# EAGLE board AdamOBrien_IOT2_PicController (EAGLE 9.6.2), part 1 of 2
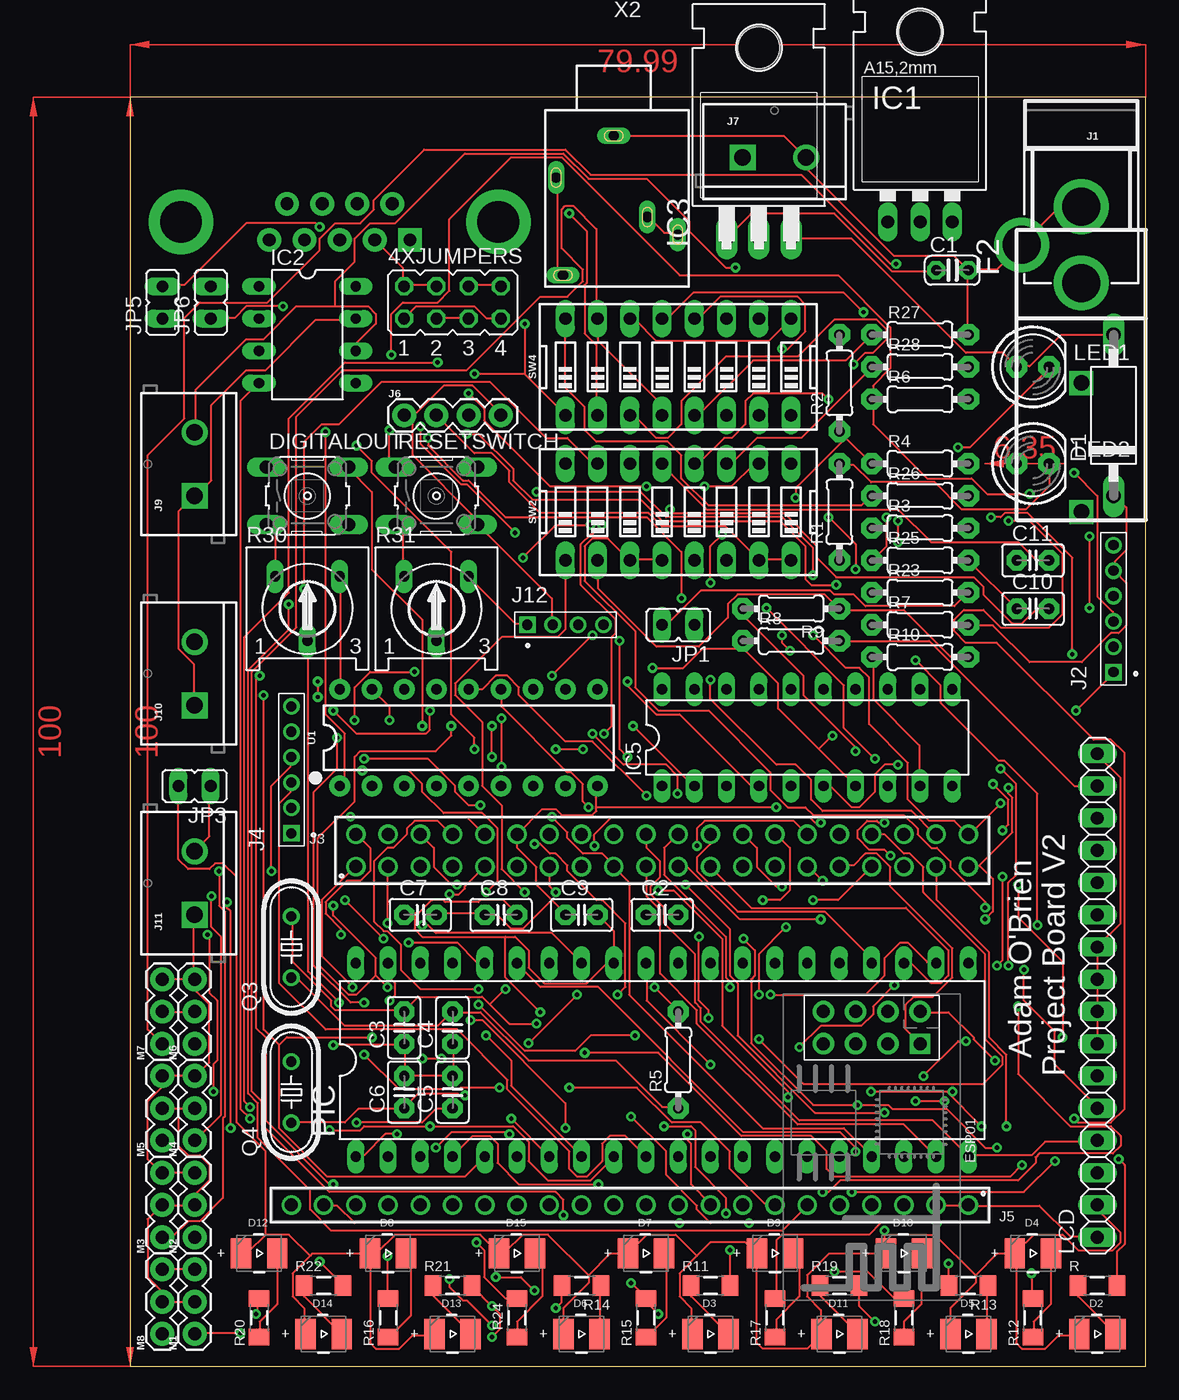
[diagram p2: board, top side]
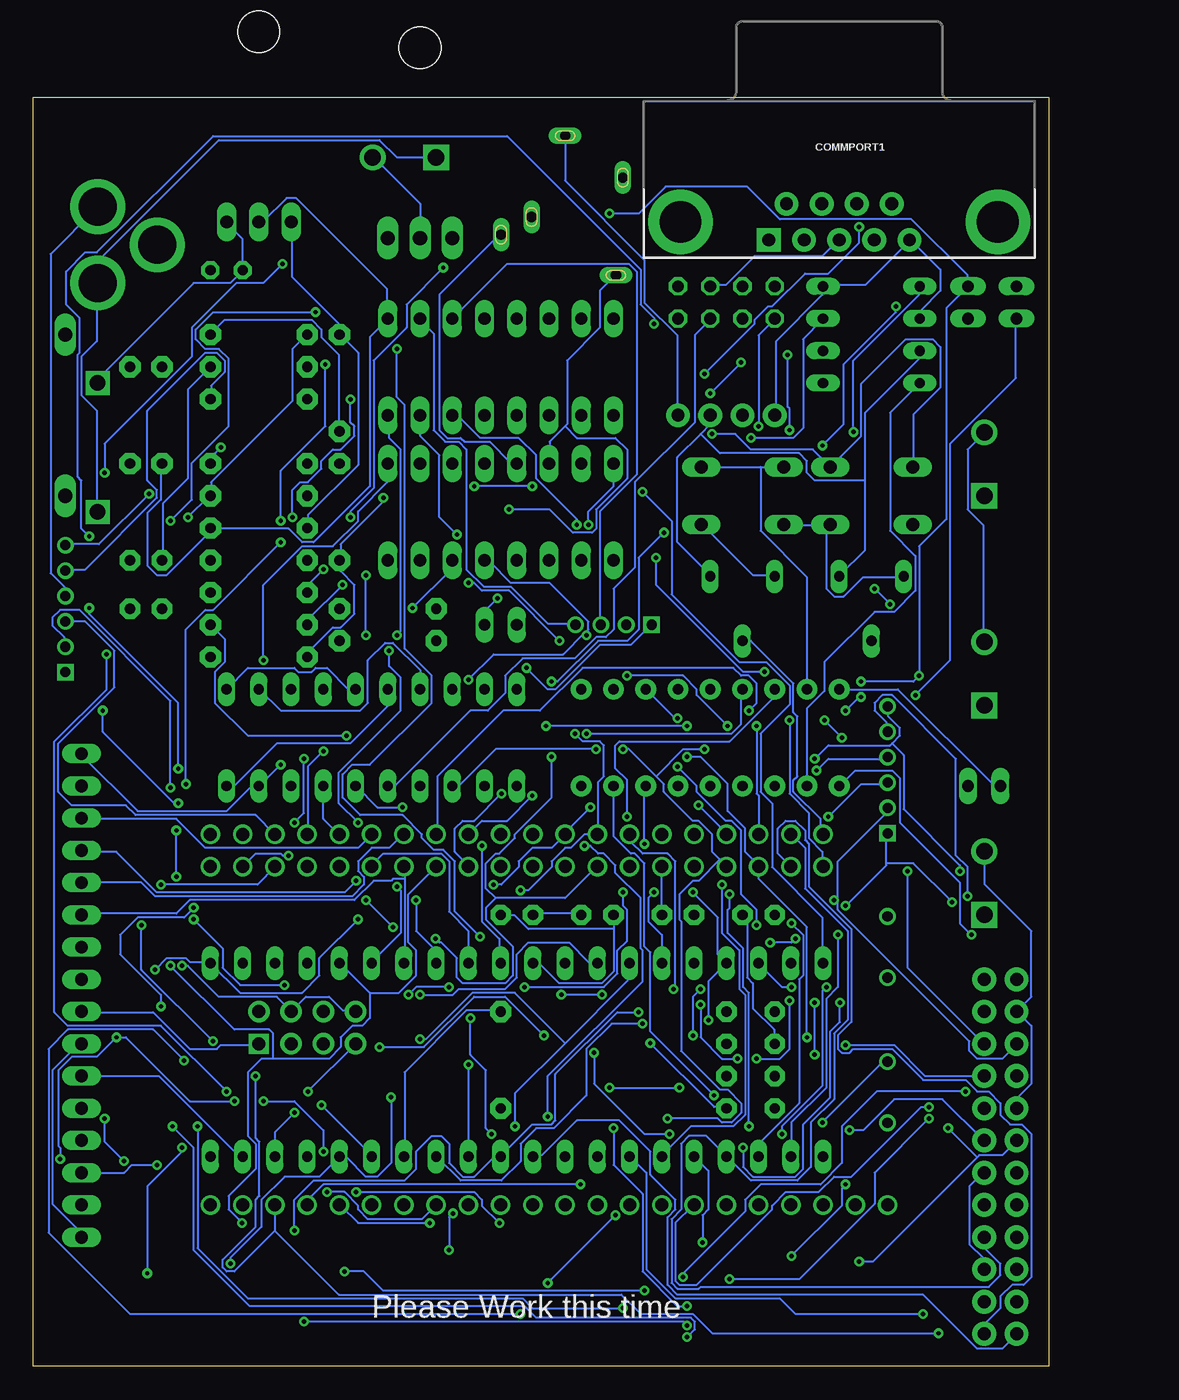
[diagram p3: board, bottom side, seen from below]

Size 79.99 x 100 mm. Coordinates in mm from the lower left corner, seen from the top.
Outline: 0,0 79.99,0 79.99,100 0,100 0,0
Copper layers (1*16): Top 0.035mm / dielectric 1.5mm / Bottom 0.035mm
Design rules "default": minimum track width 6mil, minimum drill 0.35mm, track to track 6mil, track to pad 6mil, pad to pad 6mil, via to via 6mil, smd to smd 6mil, copper to edge 40mil, drill to drill 6mil, minimum pad ring 10mil, minimum via ring 8mil, stop-mask expansion 4mil, vias tented up to drill 0mil, thermal gap 10mil

## Footprints (pad centres in the part's own frame; a part is rotated, then mirrored left to right if it is on the bottom)
JP4Q = drill 0.914 octagon: 1 -3.81,-1.27; 2 -3.81,1.27; 3 -1.27,-1.27; 4 -1.27,1.27; 5 1.27,-1.27; 6 1.27,1.27; 7 3.81,-1.27; 8 3.81,1.27
C025-024X044 = drill 0.813 pad 1.422 octagon: 1 -1.27,0; 2 1.27,0
C2.5-2 = drill 0.813 pad 1.6 octagon: 1 -1.27,0; 2 1.27,0
DB9 = drill 1.016 pad 1.88 square: 1 -5.54,-1.42 | drill 1.016 pad 1.88: 2 -2.77,-1.42; 3 0,-1.42; 4 2.77,-1.42; 5 5.54,-1.42; 6 -4.15,1.42; 7 -1.38,1.42; 8 1.38,1.42; 9 4.15,1.42 | drill 3.302 pad 5.08: G1 -12.5,0; G2 12.5,0
DO15-12 = drill 1.118 long: A 6.35,0; C -6.35,0
WL-SITW_3528 = smd 1.6 x 2.4: 1 -1.425,0; 2 1.425,0
B3F-10XX = drill 1.016 long: 1 -3.251,2.261; 2 3.251,2.261; 3 -3.251,-2.261; 4 3.251,-2.261
ESP8266_ESP-01_NO-SILKSCREEN = drill 1.016 pad 1.7: 3V3 -1.27,-3.81; EN/CH_PD -1.27,1.27; GPIO0 1.27,-1.27; GPIO2 1.27,1.27; RST -1.27,-1.27; RX 1.27,-3.81; TX -1.27,3.81 | drill 1.016 pad 1.6 square: GND 1.27,3.81
FUSE_HOLDER_MENTOR-1821 = drill 1.219 pad 1.905 square: A 10.16,0; B 0,0
TO220L1 = drill 1.016 long: 1 -2.54,-3.81; 2 0,-3.81; 3 2.54,-3.81 | hole 3.302: 0,11.176
DIL08 = drill 0.813 long: 1 -3.81,-3.81; 2 -1.27,-3.81; 3 1.27,-3.81; 4 3.81,-3.81; 5 3.81,3.81; 6 1.27,3.81; 7 -1.27,3.81; 8 -3.81,3.81
TO220H = drill 1.118 long: 1 -2.54,-10.16; 2 0,-10.16; 3 2.54,-10.16 | hole 3.302: 0,4.826
DIL20 = drill 0.813 long: 1 -11.43,-3.81; 2 -8.89,-3.81; 3 -6.35,-3.81; 4 -3.81,-3.81; 5 -1.27,-3.81; 6 1.27,-3.81; 7 3.81,-3.81; 8 6.35,-3.81; 9 8.89,-3.81; 10 11.43,-3.81; 11 11.43,3.81; 12 8.89,3.81; 13 6.35,3.81; 14 3.81,3.81; 15 1.27,3.81; 16 -1.27,3.81; 17 -3.81,3.81; 18 -6.35,3.81; 19 -8.89,3.81; 20 -11.43,3.81
POWER_JACK_PTH = drill 2.997 pad 4.318: GND 0,7.7; GNDBREAK 4.7,10.7; PWR 0,13.7
62000611121 = drill 0.8 square: 1 -5,0 | drill 0.8: 2 -3,0; 3 -1,0; 4 1,0; 5 3,0; 6 5,0
61304021821 = drill 1.02: 1 -24.13,-1.27; 2 -24.13,1.27; 3 -21.59,-1.27; 4 -21.59,1.27; 5 -19.05,-1.27; 6 -19.05,1.27; 7 -16.51,-1.27; 8 -16.51,1.27; 9 -13.97,-1.27; 10 -13.97,1.27; 11 -11.43,-1.27; 12 -11.43,1.27; 13 -8.89,-1.27; 14 -8.89,1.27; 15 -6.35,-1.27; 16 -6.35,1.27; 17 -3.81,-1.27; 18 -3.81,1.27; 19 -1.27,-1.27; 20 -1.27,1.27; 21 1.27,-1.27; 22 1.27,1.27; 23 3.81,-1.27; 24 3.81,1.27; 25 6.35,-1.27; 26 6.35,1.27; 27 8.89,-1.27; 28 8.89,1.27; 29 11.43,-1.27; 30 11.43,1.27; 31 13.97,-1.27; 32 13.97,1.27; 33 16.51,-1.27; 34 16.51,1.27; 35 19.05,-1.27; 36 19.05,1.27; 37 21.59,-1.27; 38 21.59,1.27; 39 24.13,-1.27; 40 24.13,1.27
61302211821 = drill 1.02: 1 -26.67,0; 2 -24.13,0; 3 -21.59,0; 4 -19.05,0; 5 -16.51,0; 6 -13.97,0; 7 -11.43,0; 8 -8.89,0; 9 -6.35,0; 10 -3.81,0; 11 -1.27,0; 12 1.27,0; 13 3.81,0; 14 6.35,0; 15 8.89,0; 16 11.43,0; 17 13.97,0; 18 16.51,0; 19 19.05,0; 20 21.59,0; 21 24.13,0; 22 26.67,0
1X04 = drill 1.016 pad 1.88: 1 0,0; 2 2.54,0; 3 5.08,0; 4 7.62,0
SCREWTERMINAL-5MM-2 = drill 1.3 pad 2.032 square: 1 0,0 | drill 1.3 pad 2.032: 2 5,0
62000411121 = drill 0.8 square: 1 -3,0 | drill 0.8: 2 -1,0; 3 1,0; 4 3,0
JP1 = drill 0.914 long: 1 0,-1.27; 2 0,1.27
1X16 = drill 1.016 long: 1 -19.05,0; 2 -16.51,0; 3 -13.97,0; 4 -11.43,0; 5 -8.89,0; 6 -6.35,0; 7 -3.81,0; 8 -1.27,0; 9 1.27,0; 10 3.81,0; 11 6.35,0; 12 8.89,0; 13 11.43,0; 14 13.97,0; 15 16.51,0; 16 19.05,0
LED5MM = drill 0.813 pad 1.676 octagon: A -1.27,0; K 1.27,0
1X03 = drill 1.016 pad 1.88: 1 0,0; 2 2.54,0; 3 5.08,0
DIL40 = drill 0.813 long: 1 -24.13,-7.62; 2 -21.59,-7.62; 3 -19.05,-7.62; 4 -16.51,-7.62; 5 -13.97,-7.62; 6 -11.43,-7.62; 7 -8.89,-7.62; 8 -6.35,-7.62; 9 -3.81,-7.62; 10 -1.27,-7.62; 11 1.27,-7.62; 12 3.81,-7.62; 13 6.35,-7.62; 14 8.89,-7.62; 15 11.43,-7.62; 16 13.97,-7.62; 17 16.51,-7.62; 18 19.05,-7.62; 19 21.59,-7.62; 20 24.13,-7.62; 21 24.13,7.62; 22 21.59,7.62; 23 19.05,7.62; 24 16.51,7.62; 25 13.97,7.62; 26 11.43,7.62; 27 8.89,7.62; 28 6.35,7.62; 29 3.81,7.62; 30 1.27,7.62; 31 -1.27,7.62; 32 -3.81,7.62; 33 -6.35,7.62; 34 -8.89,7.62; 35 -11.43,7.62; 36 -13.97,7.62; 37 -16.51,7.62; 38 -19.05,7.62; 39 -21.59,7.62; 40 -24.13,7.62
HC49/S = drill 0.813: 1 -2.413,0; 2 2.413,0
RC-MASTER-SMD_R1206MP = smd 1.3 x 1.6: 1 -1.524,0; 2 1.524,0
0204/7 = drill 0.813 pad 1.676 octagon: 1 -3.81,0; 2 3.81,0
RS3 = drill 0.813 long: A -2.54,2.54; E 2.54,2.54; S 0,-2.54
DIPSWITCH-08 = drill 0.97 long: 1 -8.89,-3.81; 2 -6.35,-3.81; 3 -3.81,-3.81; 4 -1.27,-3.81; 5 1.27,-3.81; 6 3.81,-3.81; 7 6.35,-3.81; 8 8.89,-3.81; 9 8.89,3.81; 10 6.35,3.81; 11 3.81,3.81; 12 1.27,3.81; 13 -1.27,3.81; 14 -3.81,3.81; 15 -6.35,3.81; 16 -8.89,3.81
DIP18 = drill 0.813 pad 1.626: 1 -10.16,-3.81; 2 -7.62,-3.81; 3 -5.08,-3.81; 4 -2.54,-3.81; 5 0,-3.81; 6 2.54,-3.81; 7 5.08,-3.81; 8 7.62,-3.81; 9 10.16,-3.81; 10 10.16,3.81; 11 7.62,3.81; 12 5.08,3.81; 13 2.54,3.81; 14 0,3.81; 15 -2.54,3.81; 16 -5.08,3.81; 17 -7.62,3.81; 18 -10.16,3.81
1503_09 = drill 0.8 pad 1.2 long: 1 0,-2.1; 2 -4.55,-5.4; 3 5.05,-9.9; 4 -4,-13.1; 5 2.65,-8.5

## Placement (x,y rotation side)
4XJUMPERS  jumpers  [JP4Q]  25.4,83.82 0 top
C1  47uF  [C025-024X044]  64.77,86.36 0 top
C2  1uF  [C2.5-2]  41.91,35.56 0 top
C3  15pF  [C2.5-2]  21.59,26.67 90 top
C4  15pF  [C2.5-2]  25.4,26.67 90 top
C5  15pF  [C2.5-2]  25.4,21.59 90 top
C6  15pF  [C2.5-2]  21.59,21.59 90 top
C7  1uF  [C2.5-2]  22.86,35.56 0 top
C8  1uF  [C2.5-2]  29.21,35.56 0 top
C9  1uF  [C2.5-2]  35.56,35.56 0 top
C10  10uF  [C2.5-2]  71.12,59.69 0 top
C11  10uF  [C2.5-2]  71.12,63.5 0 top
COMMPORT1  db9  [DB9]  16.51,90.17 0 bottom
D1  1N5060GP  [DO15-12]  77.47,74.93 90 top
D2  Led  [WL-SITW_3528]  76.2,2.54 0 top
D3  [WL-SITW_3528]  45.72,2.54 0 top
D4  bluetooth  [WL-SITW_3528]  71.12,8.89 0 top
D5  bluetooth  [WL-SITW_3528]  66.04,2.54 0 top
D6  [WL-SITW_3528]  35.56,2.54 0 top
D7  [WL-SITW_3528]  40.64,8.89 0 top
D8  [WL-SITW_3528]  20.32,8.89 0 top
D9  [WL-SITW_3528]  50.8,8.89 0 top
D10  Canbus  [WL-SITW_3528]  60.96,8.89 0 top
D11  canbus  [WL-SITW_3528]  55.88,2.54 0 top
D12  db9  [WL-SITW_3528]  10.16,8.89 0 top
D13  led  [WL-SITW_3528]  25.4,2.54 0 top
D14  [WL-SITW_3528]  15.24,2.54 0 top
D15  db9  [WL-SITW_3528]  30.48,8.89 0 top
DIGITALOUT  [B3F-10XX]  13.97,68.58 0 top
ESP01  wifi  [ESP8266_ESP-01_NO-SILKSCREEN]  58.42,26.67 270 top
F2  FUSE1821  [FUSE_HOLDER_MENTOR-1821]  74.93,77.47 270 top
IC1  LM317MABT  [TO220L1]  62.23,93.98 0 top
IC2  PCA82C250  [DIL08]  13.97,81.28 270 top
IC3  7805T  [TO220H]  49.53,99.06 0 top
IC5  MAX233  [DIL20]  53.34,49.53 0 top
J1  POWER_JACK  [POWER_JACK_PTH]  74.93,99.06 180 top
J2  6 Pin debug  [62000611121]  77.47,59.69 90 top
J3  20 PIN BREAKOUT  [61304021821]  41.91,40.64 0 top
J4  relay header  [62000611121]  12.7,46.99 90 top
J5  BREAK OUT FOR MICROBIT 22 PIN SIL  [61302211821]  39.37,12.7 180 top
J6  [1X04]  21.59,74.93 0 top
J7  [SCREWTERMINAL-5MM-2]  48.26,95.25 0 top
J9  [SCREWTERMINAL-5MM-2]  5.08,68.58 90 top
J10  [SCREWTERMINAL-5MM-2]  5.08,52.07 90 top
J11  [SCREWTERMINAL-5MM-2]  5.08,35.56 90 top
J12  Bluetooth  [62000411121]  34.29,58.42 0 top
JP1  [JP1]  43.18,58.42 90 top
JP3  [JP1]  5.08,45.72 90 top
JP5  [JP1]  2.54,83.82 0 top
JP6  [JP1]  6.35,83.82 0 top
LCD  [1X16]  76.2,29.21 90 top
LED1  red 5v  [LED5MM]  71.12,78.74 0 top
LED2  3.3v  [LED5MM]  71.12,71.12 0 top
M1  SERVO  [1X03]  5.08,2.54 90 top
M2  SERVO  [1X03]  5.08,10.16 90 top
M3  SERVO  [1X03]  2.54,10.16 90 top
M4  SERVO  [1X03]  5.08,17.78 90 top
M5  SERVO  [1X03]  2.54,17.78 90 top
M6  SERVO  [1X03]  5.08,25.4 90 top
M7  SERVO  [1X03]  2.54,25.4 90 top
M8  SERVO  [1X03]  2.54,2.54 90 top
PIC  PIC16F877P  [DIL40]  41.91,24.13 0 top
Q3  20M  [HC49/S]  12.7,33.02 90 top
Q4  16M  [HC49/S]  12.7,21.59 90 top
R  200  [RC-MASTER-SMD_R1206MP]  76.2,6.35 0 top
R1  470  [0204/7]  55.88,67.31 90 top
R2  360  [0204/7]  55.88,77.47 90 top
R3  220  [0204/7]  62.23,66.04 0 top
R4  470  [0204/7]  62.23,71.12 0 top
R5  330  [0204/7]  43.18,24.13 90 top
R6  4.7k  [0204/7]  62.23,76.2 0 top
R7  4.7k  [0204/7]  62.23,58.42 0 top
R8  100  [0204/7]  52.07,57.15 0 top
R9  1000  [0204/7]  52.07,59.69 180 top
R10  2000  [0204/7]  62.23,55.88 0 top
R11  200  [RC-MASTER-SMD_R1206MP]  45.72,6.35 0 top
R12  200  [RC-MASTER-SMD_R1206MP]  71.12,3.81 90 top
R13  200  [RC-MASTER-SMD_R1206MP]  66.04,6.35 180 top
R14  200  [RC-MASTER-SMD_R1206MP]  35.56,6.35 180 top
R15  200  [RC-MASTER-SMD_R1206MP]  40.64,3.81 90 top
R16  200  [RC-MASTER-SMD_R1206MP]  20.32,3.81 90 top
R17  200  [RC-MASTER-SMD_R1206MP]  50.8,3.81 90 top
R18  200  [RC-MASTER-SMD_R1206MP]  60.96,3.81 90 top
R19  200  [RC-MASTER-SMD_R1206MP]  55.88,6.35 0 top
R20  200  [RC-MASTER-SMD_R1206MP]  10.16,3.81 90 top
R21  200  [RC-MASTER-SMD_R1206MP]  25.4,6.35 0 top
R22  200  [RC-MASTER-SMD_R1206MP]  15.24,6.35 0 top
R23  470  [0204/7]  62.23,60.96 0 top
R24  200  [RC-MASTER-SMD_R1206MP]  30.48,3.81 90 top
R25  1K  [0204/7]  62.23,63.5 0 top
R26  1000  [0204/7]  62.23,68.58 0 top
R27  2000  [0204/7]  62.23,81.28 0 top
R28  1K  [0204/7]  62.23,78.74 0 top
R30  10k  [RS3]  13.97,59.69 0 top
R31  10k  [RS3]  24.13,59.69 0 top
RESETSWITCH  [B3F-10XX]  24.13,68.58 0 top
SW2  [DIPSWITCH-08]  43.18,67.31 0 top
SW4  [DIPSWITCH-08]  43.18,78.74 0 top
U1  MCP2515  [DIP18]  26.67,49.53 0 top
X2  1503_09  [1503_09]  38.1,99.06 0 top